# Altium schematic sheet Power System.SchDoc
size A
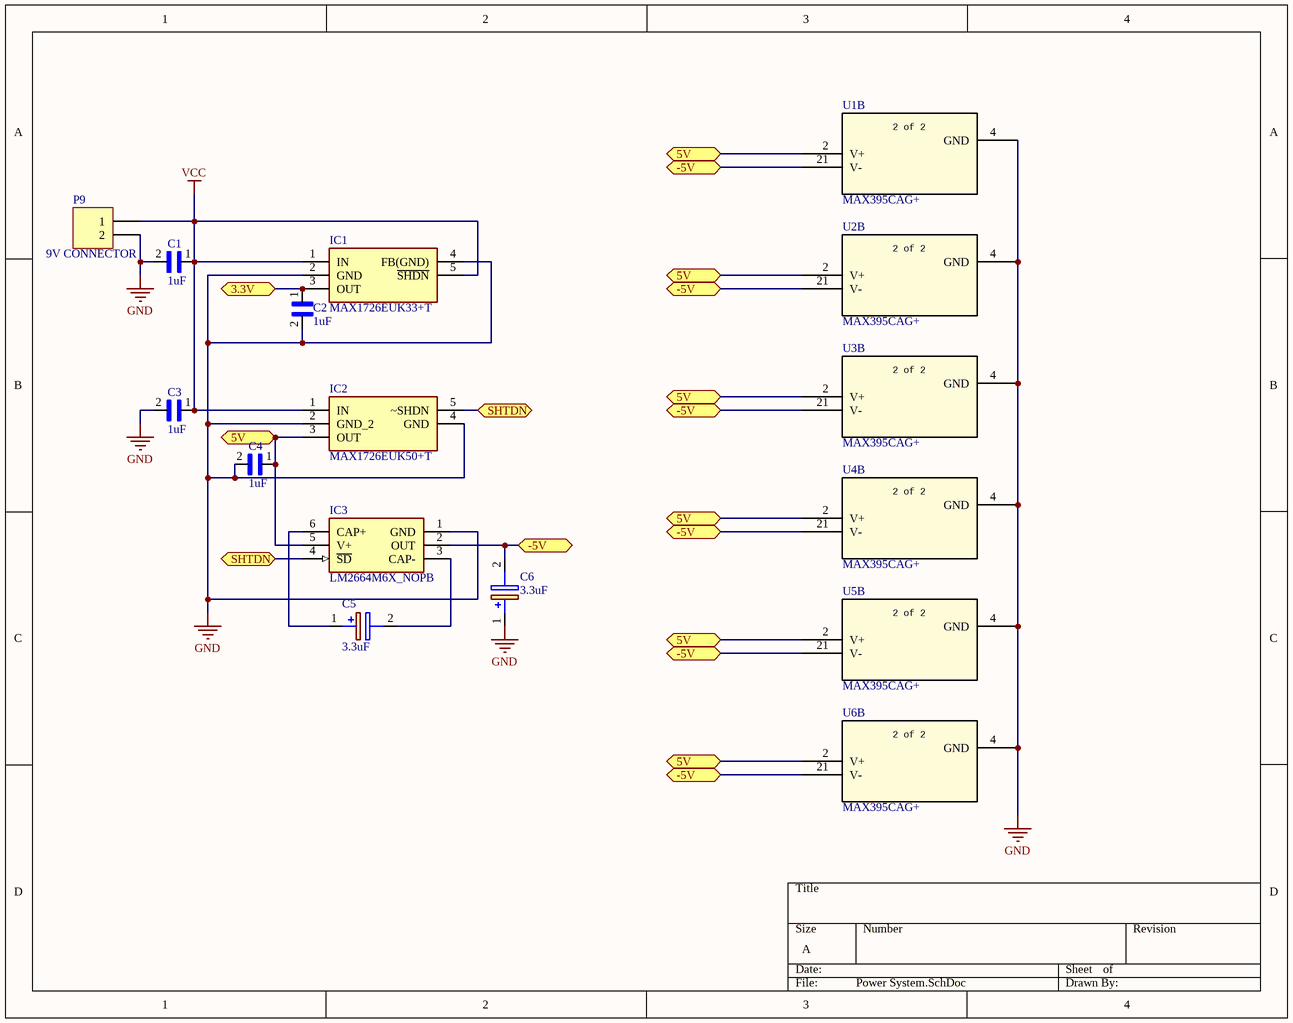
[diagram p0: Power System.SchDoc]

## Parts
C1  1uF  [CAPC2012X135N]
C2  1uF  [CAPC2012X135N]
C3  1uF  [CAPC2012X135N]
C4  1uF  [CAPC2012X135N]
C5  3.3uF  [CAPAE430X550N]
C6  3.3uF  [CAPAE430X550N]
IC1  MAX1726EUK33+T  [SOT95P280X145-5N]
IC2  MAX1726EUK50+T  [SOT95P280X145-5N]
IC3  LM2664M6X_NOPB  [SOT95P280X145-6N]
P9  9V CONNECTOR  [HDR1X2]
U1  MAX395CAG+  [21-0056C_24_MXM]  (part B of 2)
U2  MAX395CAG+  [21-0056C_24_MXM]  (part B of 2)
U3  MAX395CAG+  [21-0056C_24_MXM]  (part B of 2)
U4  MAX395CAG+  [21-0056C_24_MXM]  (part B of 2)
U5  MAX395CAG+  [21-0056C_24_MXM]  (part B of 2)
U6  MAX395CAG+  [21-0056C_24_MXM]  (part B of 2)

## Ports
3.3V, 5V, -5V, SHTDN

## Nets
GND: C1.2 C2.2 C3.2 C4.2 C6.1(+) IC1.2(GND) IC1.4(FB(GND)) IC2.2(GND_2) IC2.4(GND) IC3.1(GND) P9.2 U1.4(GND) U2.4(GND) U3.4(GND) U4.4(GND) U5.4(GND) U6.4(GND)
VCC: C1.1 C3.1 IC1.1(IN) IC1.5(~{SHDN}) IC2.1(IN) P9.1
3.3V: C2.1 IC1.3(OUT) ; port 3.3V
5V: C4.1 IC2.3(OUT) IC3.5(V+) U1.2(V+) U2.2(V+) U3.2(V+) U4.2(V+) U5.2(V+) U6.2(V+) ; port 5V
-5V: C6.2(-) IC3.2(OUT) U1.21(V-) U2.21(V-) U3.21(V-) U4.21(V-) U5.21(V-) U6.21(V-) ; port -5V
SHTDN: IC2.5(~SHDN) IC3.4(~{SD}) ; port SHTDN
NetC5_1: C5.1(+) IC3.6(CAP+)
NetC5_2: C5.2(-) IC3.3(CAP-)

## Notes on the sheet
- (in symbol MAX395CAG+, part B) 2 of 2

## Library data of the parts
C1-C4 = TMK212B7105KGHTR: 1ÂµF Â±10% 25V Ceramic Capacitor X7R 0805 _2012 Metric_; MF: Taiyo Yuden; Digi-Key_Part_Number: 587-6357-1-ND; Package: 2012 Taiyo Yuden; MP: TMK212B7105KGHTR; SnapEDA_Link: https://www.snapeda.com/parts/TMK212B7105KGHTR/Taiyo%20Yuden/view-part/1813294/?ref=snap; Digi-Key_Purchase_URL: https://www.digikey.ca/product-detail/en/taiyo-yuden/TMK212B7105KGHTR/587-6357-1-ND/9949943?utm_source=snapeda&utm_medium=aggregator&utm_campaign=symbol; Value: *
C5 C6 = 16SVP3R3M: Capacitor Polarised; Manufacturer_Name: Panasonic; Datasheet Link: https://industrial.panasonic.com/cdbs/www-data/pdf/AAB8000/AAB8000C193.pdf; Height: 5.5mm; Manufacturer_Part_Number: 16SVP3R3M; Arrow Part Number: 16SVP3R3M; Arrow Price/Stock: https://www.arrow.com/en/products/16svp3r3m/panasonic; Mouser Part Number: 667-16SVP3R3M; Mouser Price/Stock: https://www.mouser.com/Search/Refine.aspx?Keyword=667-16SVP3R3M
IC1 = MAX1726EUK33+T: Integrated Circuit; Manufacturer_Name: Maxim Integrated; Datasheet Link: https://datasheets.maximintegrated.com/en/ds/MAX1725-MAX1726.pdf; Height: 1.45mm; Manufacturer_Part_Number: MAX1726EUK33+T; Arrow Part Number: MAX1726EUK33+T; Mouser Part Number: 700-MAX1726EUK33T; Mouser Price/Stock: https://www.mouser.com/Search/Refine.aspx?Keyword=700-MAX1726EUK33T
IC2 = MAX1726EUK50+T: Integrated Circuit; Manufacturer_Name: Maxim Integrated; Datasheet Link: http://componentsearchengine.com/Datasheets/1/MAX1726EUK50+T.pdf; Manufacturer_Part_Number: MAX1726EUK50+T; Arrow Part Number: MAX1726EUK50+T; Mouser Part Number: 700-MAX1726EUK50T; Mouser Price/Stock: https://www.mouser.co.uk/ProductDetail/Maxim-Integrated/MAX1726EUK50%2bT?qs=Jw2w9zrI6w%252Bbrdx6zz2S%2FQ%3D%3D
IC3 = LM2664M6X_NOPB: Integrated Circuit; Manufacturer_Name: Texas Instruments; Manufacturer_Part_Number: LM2664M6X/NOPB; Datasheet Link: https://componentsearchengine.com/Datasheets/2/LM2664M6X_NOPB.pdf; Height: 1.45mm; Arrow Part Number: LM2664M6X/NOPB; Arrow Price/Stock: https://www.arrow.com/en/products/lm2664m6xnopb/texas-instruments; Mouser Part Number: 926-LM2664M6X/NOPB; Mouser Price/Stock: https://www.mouser.co.uk/ProductDetail/Texas-Instruments/LM2664M6X-NOPB?qs=X1J7HmVL2ZHEhyIijWLH%252BA%3D%3D
P9 = Header 2: Header, 2-Pin; LatestRevisionDate: 17-Jul-2002; LatestRevisionNote: Re-released for DXP Platform.; Publisher: Altium Limited
U1-U6 = MAX395CAG+: No Description Available; SourceLibrary: Maxim_2014-05-21; Built_By: EMA_UL_Team; Vendor: Maxim Integrated Products; Manufacturer_Part_Number: MAX395CAG+; Copyright: Copyright (C) 2018 Accelerated Designs. All rights reserved; RefDes: RefDes; Type: DEV